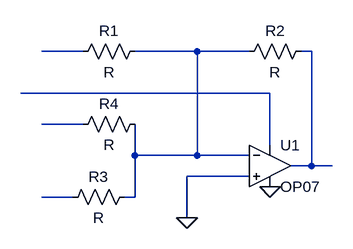
[diagram p0: schematic Summing.asc]
Summing.asc, the LTspice schematic file:
Version 4
SHEET 1 1028 680
WIRE 640 0 576 0
WIRE 816 0 720 0
WIRE 896 0 816 0
WIRE 992 0 976 0
WIRE 928 64 544 64
WIRE 640 112 576 112
WIRE 928 144 928 64
WIRE 720 160 720 112
WIRE 816 160 816 0
WIRE 816 160 720 160
WIRE 896 160 816 160
WIRE 992 176 992 0
WIRE 992 176 960 176
WIRE 1024 176 992 176
WIRE 896 192 800 192
WIRE 624 224 576 224
WIRE 720 224 720 160
WIRE 720 224 704 224
WIRE 800 256 800 192
FLAG 800 256 0
FLAG 928 208 0
SYMBOL res 736 -16 R90
WINDOW 0 0 56 VBottom 2
WINDOW 3 32 56 VTop 2
SYMATTR InstName R1
SYMBOL res 720 208 R90
WINDOW 0 0 56 VBottom 2
WINDOW 3 32 56 VTop 2
SYMATTR InstName R3
SYMBOL res 736 96 R90
WINDOW 0 0 56 VBottom 2
WINDOW 3 32 56 VTop 2
SYMATTR InstName R4
SYMBOL OpAmps\\OP07 928 112 R0
SYMATTR InstName U1
SYMBOL res 992 -16 R90
WINDOW 0 0 56 VBottom 2
WINDOW 3 32 56 VTop 2
SYMATTR InstName R2

The netlist it stands for:
* Summing.asc
R1 N002 N001 R
R3 N002 N006 R
R4 N002 N005 R
XU1 0 N002 N004 0 N003 LT1001  ; OP07, pins In+ In- V+ V- OUT
R2 N003 N002 R
.lib LTC.lib
.backanno
.end